# EAGLE design 205_proximity (EAGLE 7.6.0)
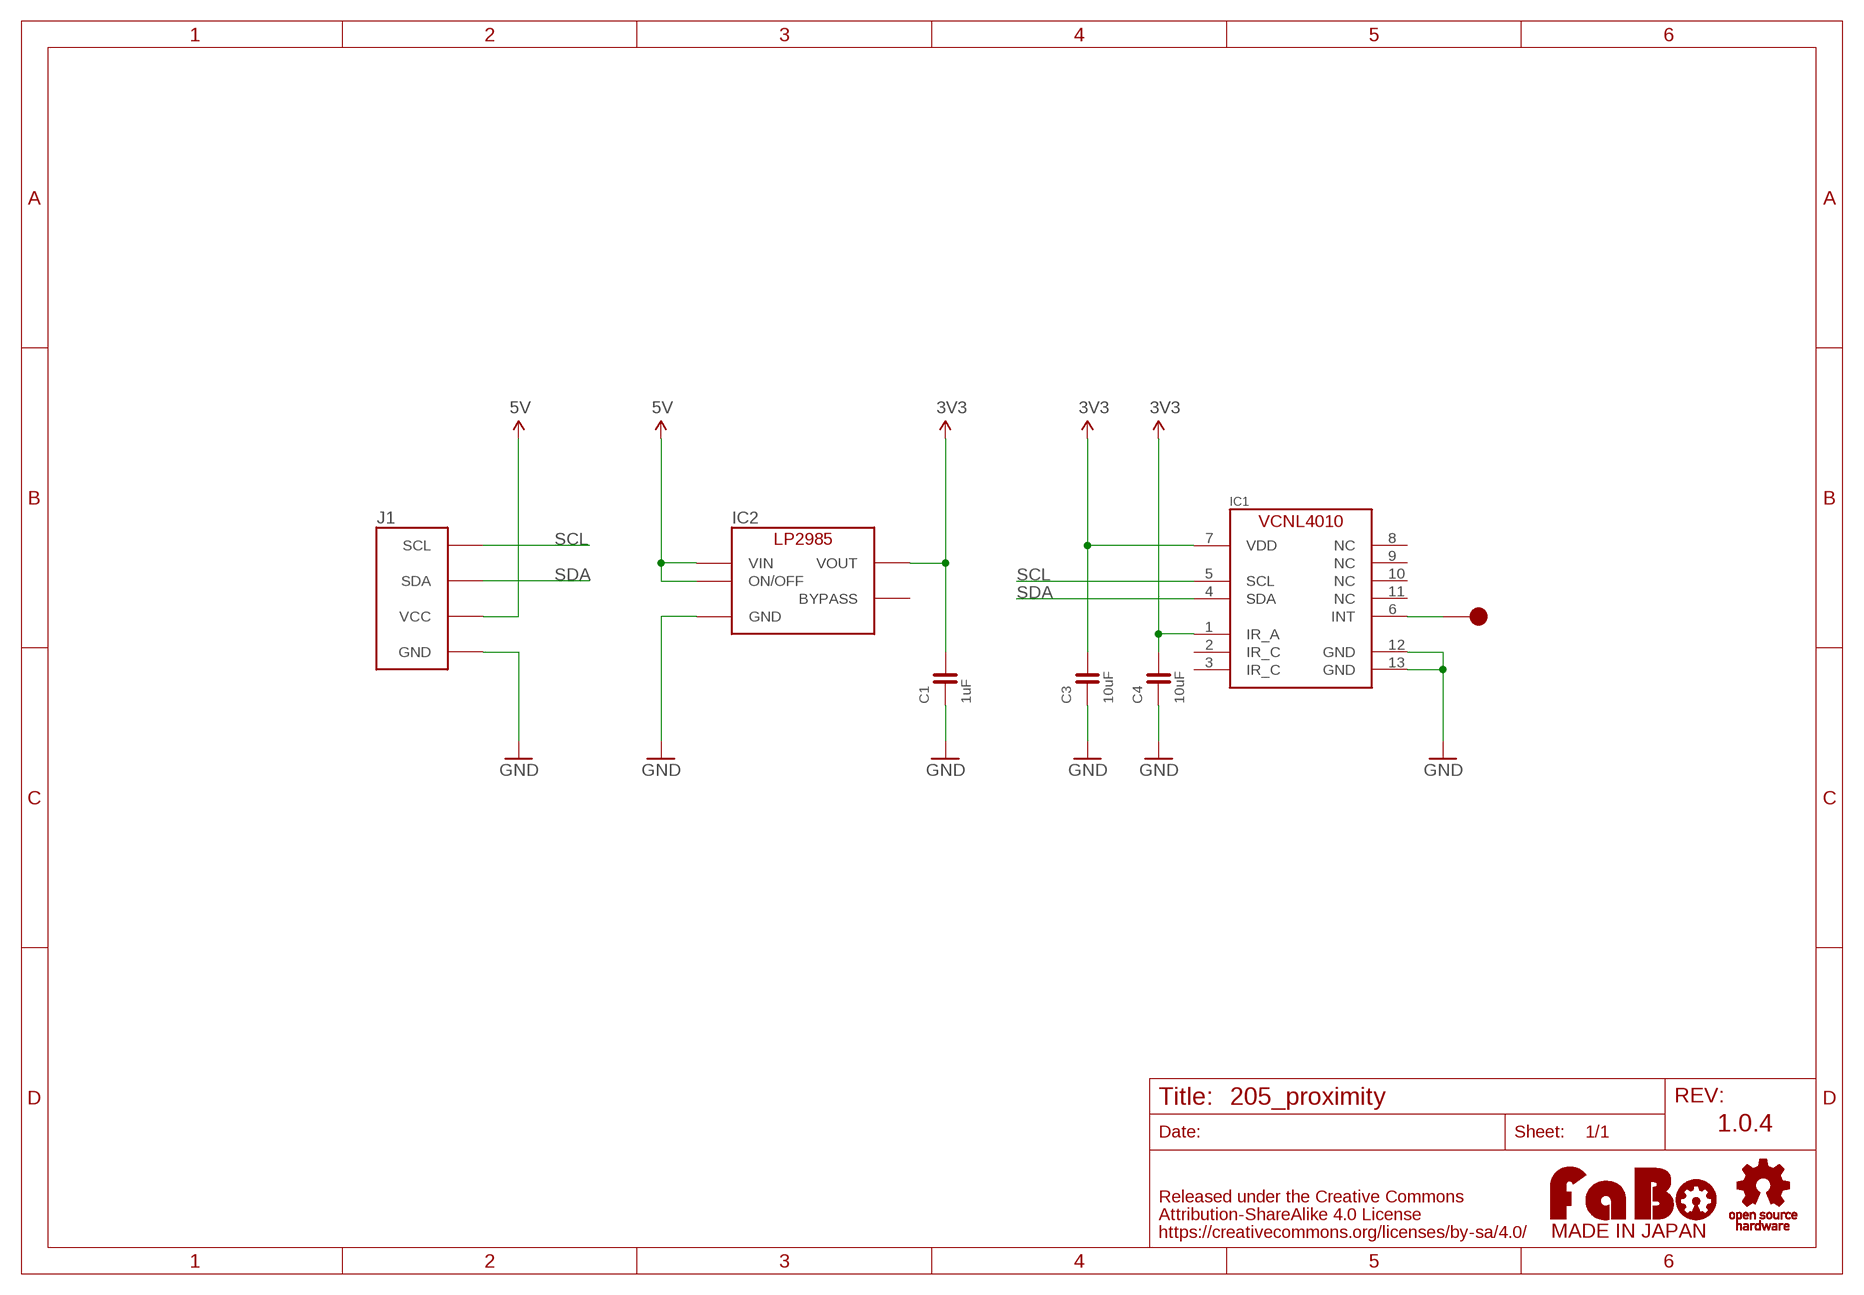
[diagram p0: schematic, sheet 1]

## Parts
C1  1uF  CAPACITOR-0603  [0603]
C3  10uF  CAPACITOR-0603  [0603]
C4  10uF  CAPACITOR-0603  [0603]
IC1  VCNL4010  [VCNL4010-GS08]
IC2  LP2985-33DBV  [SOT-23-5]
J1  FABO_BRICK_I2C  [FABO_BRICK_I2C]
TP1  TP-15  [TP-15]
U$2  LOGO_OSHW-M_BOTTOM  [LOGO_OSHW_M_BOTTOM]
U$3  LOGO_FABO-M  [LOGO_FABO_MS]

## Nets
3V3: C1.2 C3.2 C4.2 IC1.1(IR_A) IC1.7(VDD) IC2.5(VOUT)
5V: IC2.1(VIN) IC2.3(ON/OFF) J1.VCC
GND: C1.1 C3.1 C4.1 IC1.12(GND) IC1.13(GND) IC2.2(GND) J1.GND
N$2: IC1.6(INT) TP1.1
SCL: IC1.5(SCL) J1.SCL
SDA: IC1.4(SDA) J1.SDA
Unconnected: IC1.2(IR_C) IC1.3(IR_C) IC1.8(NC) IC1.9(NC) IC1.10(NC) IC1.11(NC) IC2.4(BYPASS)

## Notes on the sheet
- 1.0.4

## Library data of the parts
C1 C3 C4 = FaBo-Capacitor:CAPACITOR: CAPACITOR
IC1 = FaBo-Sensor:VCNL4010
IC2 = FaBo-Supply:LP2985: LP2985
J1 = FaBo-Template:FABO_BRICK_I2C: FaBo Brick I2C
TP1 = FaBo-Supply:TP
U$2 = FaBo-etc:LOGO_OSHW
U$3 = FaBo-etc:LOGO_FABO

## Board
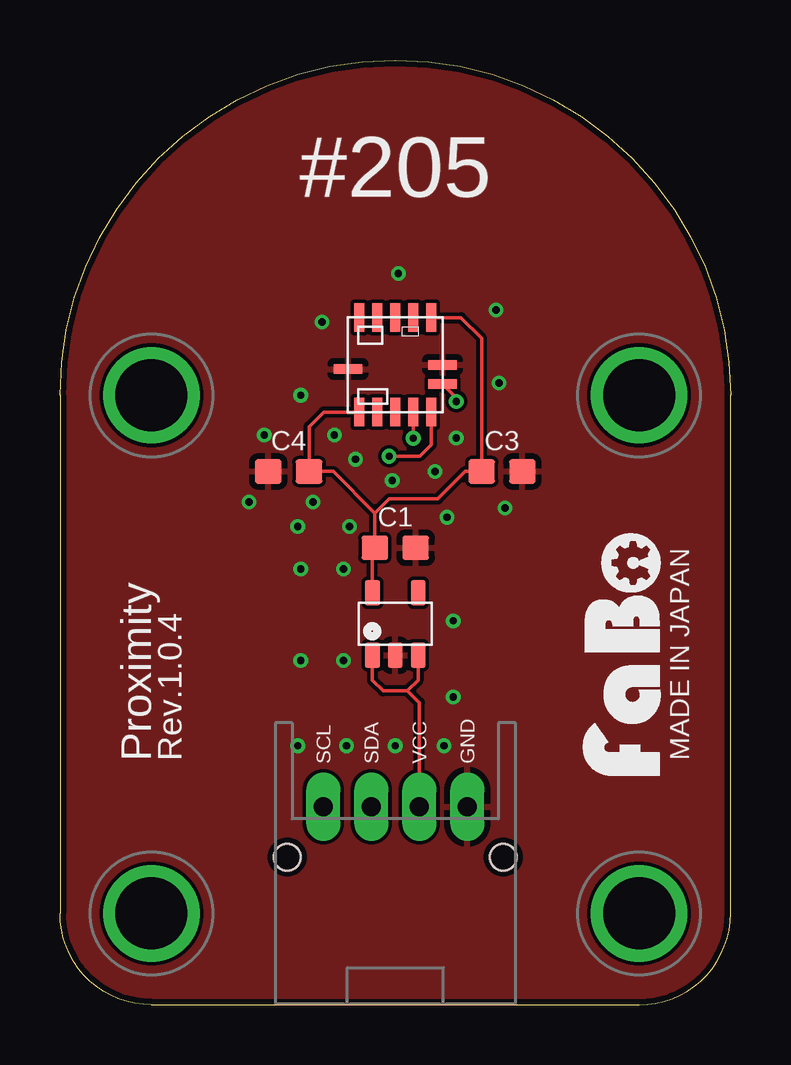
[diagram p1: board, top side]
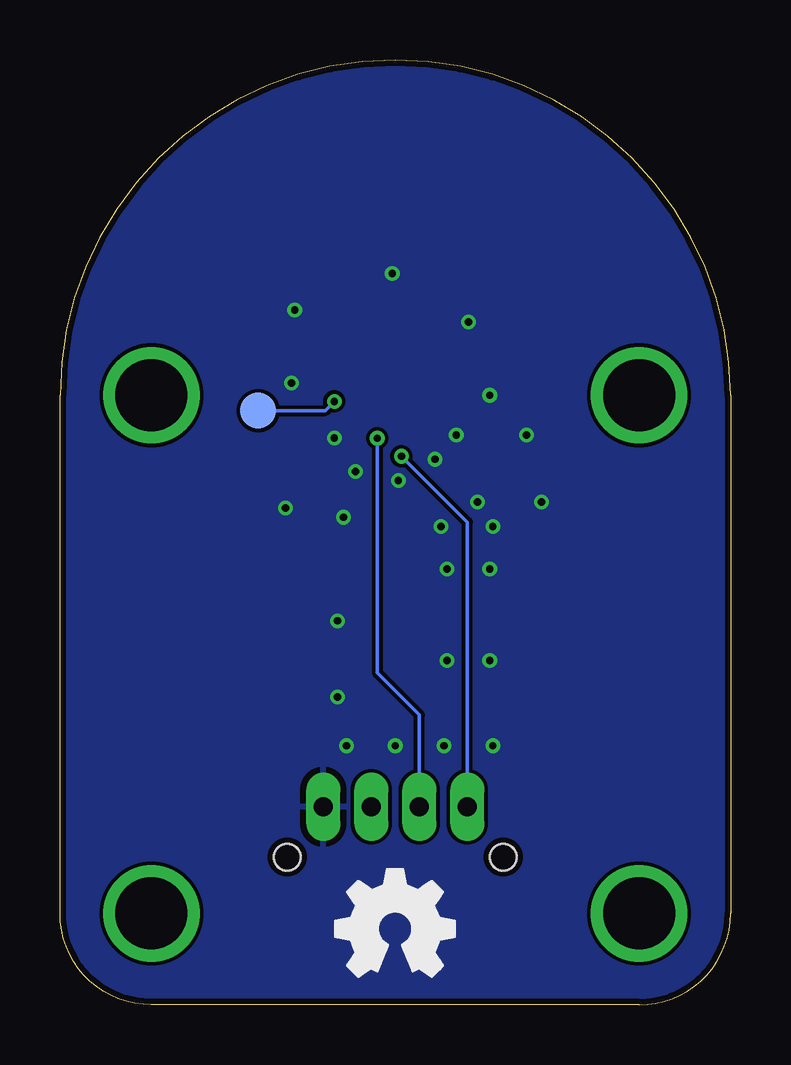
[diagram p2: board, bottom side, seen from below]

Size 27.94 x 39.37 mm. Coordinates in mm from the lower left corner, seen from the top.
Copper layers (1*16): Top 0.035mm / dielectric 1.5mm / Bottom 0.035mm
Design rules "SeeedStudio_2layer_DRU_no_angle_20140221": minimum track width 6mil, minimum drill 12mil, track to track 6mil, track to pad 6mil, pad to pad 6mil, via to via 6mil, smd to smd 0mil, copper to edge 10mil, drill to drill 10mil, minimum pad ring 10mil, minimum via ring 6mil, stop-mask expansion 2mil, vias tented up to drill 100mil, thermal gap 10mil

### Footprints (pad centres in the part's own frame; a part is rotated, then mirrored left to right if it is on the bottom)
0603 = smd 1.1 x 1: 1 -0.85,0; 2 0.85,0
VCNL4010-GS08 = smd 0.4 x 1.2: 1 -1.5,-1.97; 2 -0.75,-1.97; 3 0,-1.97; 4 0.75,-1.97; 5 1.5,-1.97; 7 1.5,1.97; 8 0.75,1.97; 9 0,1.97; 10 -0.75,1.97; 11 -1.5,1.97 | smd 1.2 x 0.4: 6 1.97,-0.8; 12 -1.97,-0.175; 13 1.97,0
SOT-23-5 = smd 0.6 x 1.05: 1 -0.95,-1.3; 2 0,-1.3; 3 0.95,-1.3; 4 0.95,1.3; 5 -0.95,1.3
FABO_BRICK_I2C = drill 0.8 pad 1.422 long: GND 3,-10.795; SCL -3,-10.795; SDA -1,-10.795; VCC 1,-10.795 | drill 3 pad 3.81: P$1 -10.16,6.35; P$2 10.16,6.35; P$3 -10.16,-15.24; P$4 10.16,-15.24 | hole 1.1: -4.5,-12.895; 4.5,-12.895
TP-15 = smd 1.5 x 1.5: 1 0,0

### Placement (x,y rotation side)
C1  13.97,19.05 180 top
C3  18.41,22.23 180 top
C4  9.53,22.23 0 top
IC1  13.97,26.67 0 top
IC2  13.97,15.88 0 top
J1  13.97,19.05 0 top
TP1  19.68,24.77 0 bottom
U$2  13.97,3.17 0 top
U$3  25.4,14.61 90 top

### Tracks (layer width: path | path; a pad name or v marks a point on that pad's centre or on a via)
3V3
  Top 0.152: IC2.5 13.02,18.95 C1.2 13.12,20.49 | IC1.1 10.98,24.7 10.38,24.09 C4.2 11.38,22.23 13.12,20.49 | IC1.7 16.7,28.64 17.57,27.77 C3.2 16.89,22.23 15.75,21.08 13.72,21.08 13.12,20.49
5V
  Top 0.152: IC2.1 13.02,13.52 13.46,13.08 14.48,13.08 | IC2.3 14.92,13.52 14.48,13.08 | J1.VCC 14.97,12.59 14.48,13.08
GND  (via drill 0.3)
  other vias: 11.43,23.75 16.51,23.62 13.84,21.84 12.32,22.73 10.54,20.95 12.06,19.94 16.13,20.32 18.29,25.91 10.03,25.4 16.38,16 11.81,18.16 9.91,19.94 9.91,10.79 11.94,10.79 13.97,10.79 16,10.79 10.03,18.16 10.03,14.35 11.81,14.35 16.38,12.83 18.16,28.96 18.54,20.7 8.51,23.75 7.87,20.95 15.62,22.23 10.92,28.45 14.1,30.48
  pour Bottom: 0,0 27.94,0 27.94,39.37 0,39.37
  pour Top: 0,0 27.94,0 27.94,39.37 0,39.37
N$2  (via drill 0.3)
  Top 0.152: v16.51,25.15 16.51,25.3 IC1.6
  Bottom 0.152: TP1.1 16.89,24.77 v16.51,25.15
SCL  (via drill 0.3)
  Top 0.152: IC1.5 15.47,23.34 14.99,22.86 v13.72,22.86
  Bottom 0.152: v13.72,22.86 10.97,20.11 J1.SCL
SDA  (via drill 0.3)
  Top 0.152: IC1.4 v14.72,23.61
  Bottom 0.152: J1.SDA 12.97,12.08 14.72,13.83 v14.72,23.61

### Text on the board
tPlace: #205 | MADE IN JAPAN | Proximity | Rev.1.0.4